# EAGLE design H00R0-H (EAGLE 9.6.1)
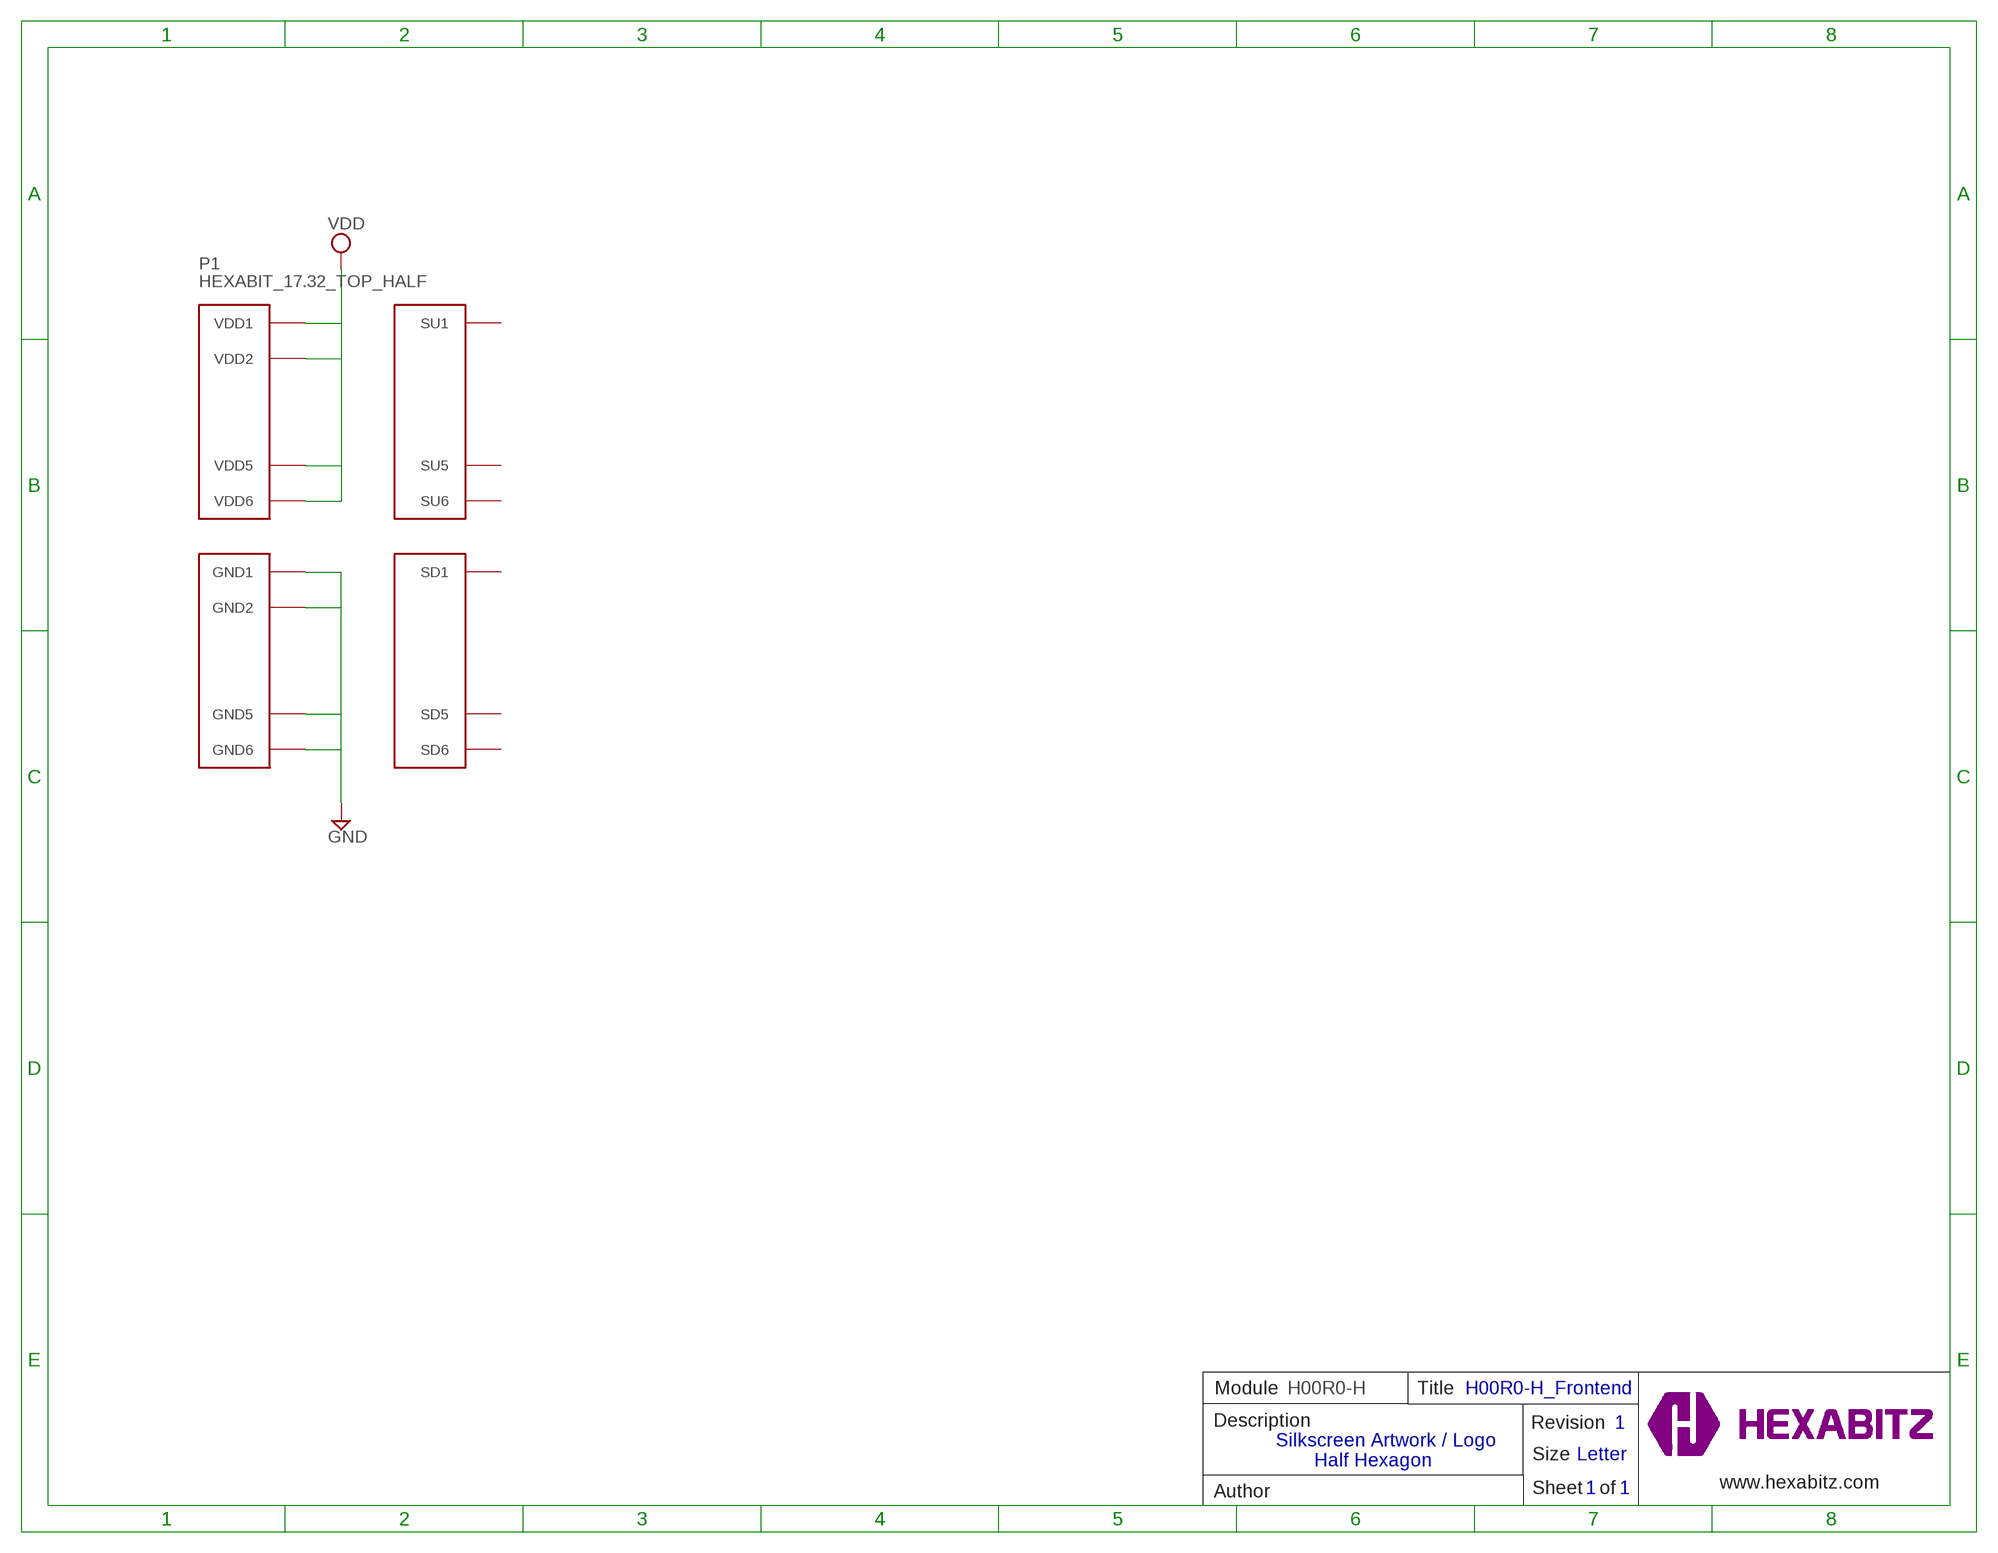
[diagram p0: schematic, sheet 1]

## Parts
P1  HEXABIT_17.32_TOP_HALF  [HEXABIT_17.32_TOP_HALF]
TRIMBLE-LOGO1  HEXABITZ-LOGO  [HEXABITZ-LOGO]

## Nets
GND: P1.PAD_PD7(GND1) P1.PAD_PD8(GND2) P1.PAD_PD11(GND5) P1.PAD_PD12(GND6)
VDD: P1.PAD_PU7(VDD1) P1.PAD_PU8(VDD2) P1.PAD_PU11(VDD5) P1.PAD_PU12(VDD6)
Unconnected: P1.PAD_PD1(SD1) P1.PAD_PD5(SD5) P1.PAD_PD6(SD6) P1.PAD_PU1(SU1) P1.PAD_PU5(SU5) P1.PAD_PU6(SU6)

## Notes on the sheet
- Module | H00R0-H | Title | H00R0-H_Frontend
- Description | Revision | 1
- Size | Letter
- Silkscreen Artwork / Logo 
         Half Hexagon
- www.hexabitz.com
- Author | Sheet   of | 1 | 1

## Library data of the parts
P1 = hexabitz_connectors:HEXABIT_17.32_TOP_HALF: Hexabitz Hexagon Module Connector Hexagon side length = 17.32mm.
TRIMBLE-LOGO1 = HEXABITZ_USER_INTERFACE_PARTS:HEXABITZ-LOGO: Trimble-Logo

## Board
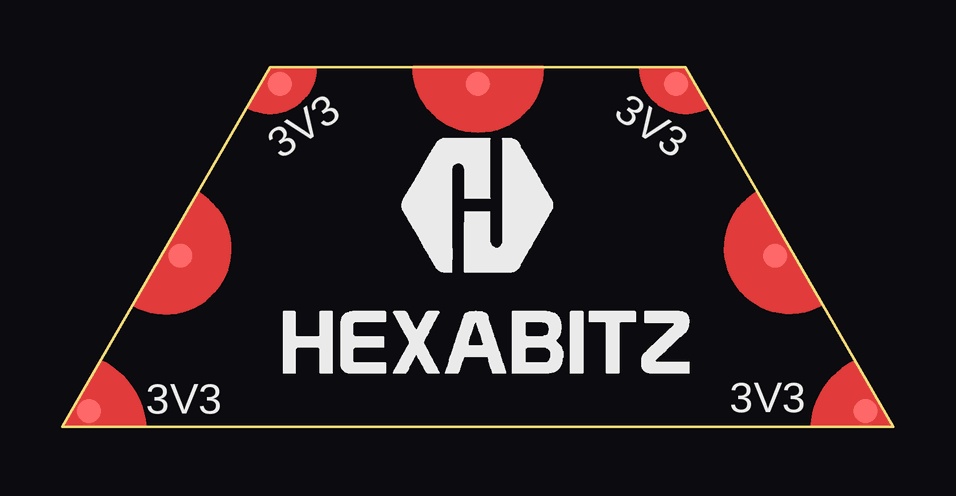
[diagram p1: board, top side]
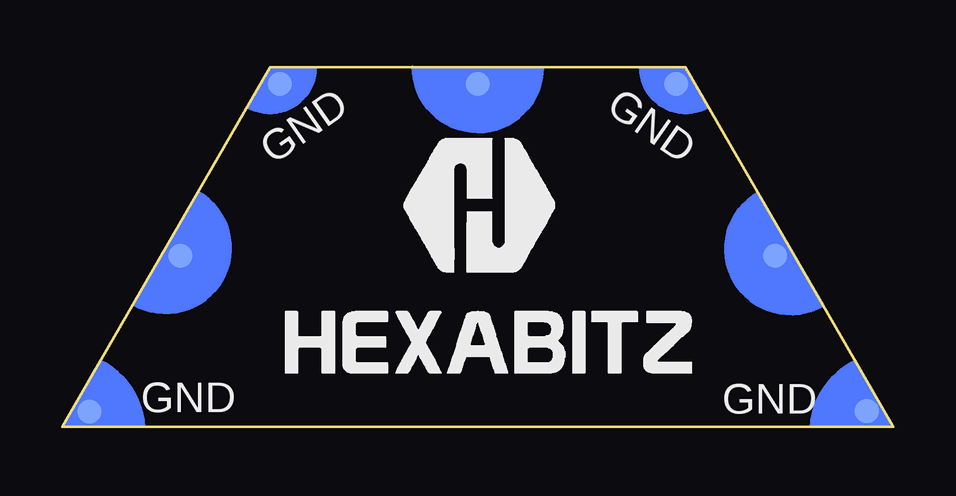
[diagram p2: board, bottom side, seen from below]

Size 34.64 x 15 mm. Coordinates in mm from the lower left corner, seen from the top.
Copper layers (1*16): Top 0.035mm / dielectric 1.5mm / Bottom 0.035mm
Design rules "2_layer *": minimum track width 7mil, minimum drill 10mil, track to track 6mil, track to pad 32mil, pad to pad 32mil, via to via 6mil, smd to smd 0mil, copper to edge 1mil, drill to drill 8mil, minimum pad ring 10mil, minimum via ring 8mil, stop-mask expansion 2mil, vias tented up to drill 15mil, thermal gap 10mil
tRestrict: area 9.2,-8.2 to 25.4,8.1
bRestrict: area 9.2,-8.2 to 25.4,8.1

### Footprints (pad centres in the part's own frame; a part is rotated, then mirrored left to right if it is on the bottom)
HEXABIT_17.32_TOP_HALF = smd 1 x 1 bottom: PAD_PD1 12.39,7.15; PAD_PD5 -12.39,7.15; PAD_PD6 0,14.31; PAD_PD7 8.26,14.31; PAD_PD8 16.19,0.635; PAD_PD11 -16.215,0.66; PAD_PD12 -8.26,14.31 | smd 1 x 1: PAD_PU1 12.39,7.15; PAD_PU5 -12.39,7.15; PAD_PU6 0,14.31; PAD_PU7 8.26,14.31; PAD_PU8 16.164,0.66; PAD_PU11 -16.215,0.66; PAD_PU12 -8.26,14.31

### Placement (x,y rotation side)
P1  17.32,0 0 top
TRIMBLE-LOGO1  13.31,-0.28 0 top

### Tracks (layer width: path | path; a pad name or v marks a point on that pad's centre or on a via)
GND
  pour Bottom (no thermals): 0.02,-0.01 34.62,-0.01 34.64,0 25.98,15 8.66,15 0,0
VDD
  pour Top (no thermals): 0.15,-0.01 34.62,-0.01 34.64,0 25.98,15 8.66,15 0,0

### Text on the board
tPlace: 3V3 | 3V3 | 3V3 | 3V3
bPlace: GND | GND | GND | GND